# Altium schematic sheet Cover.SchDoc: COVER
size A4; Author: José Báez; CompanyName: Onubense de Sistemas Cuatro-20 S.L.; DrawnBy: José Báez; Address1: C/ Islas Malvinas n.7; Address2: 21007 Huelva; Address3: Spain; DocumentNumber: 1; Revision: 0; SheetNumber: 1; SheetTotal: 7; CreatedDate: 25/09/2026
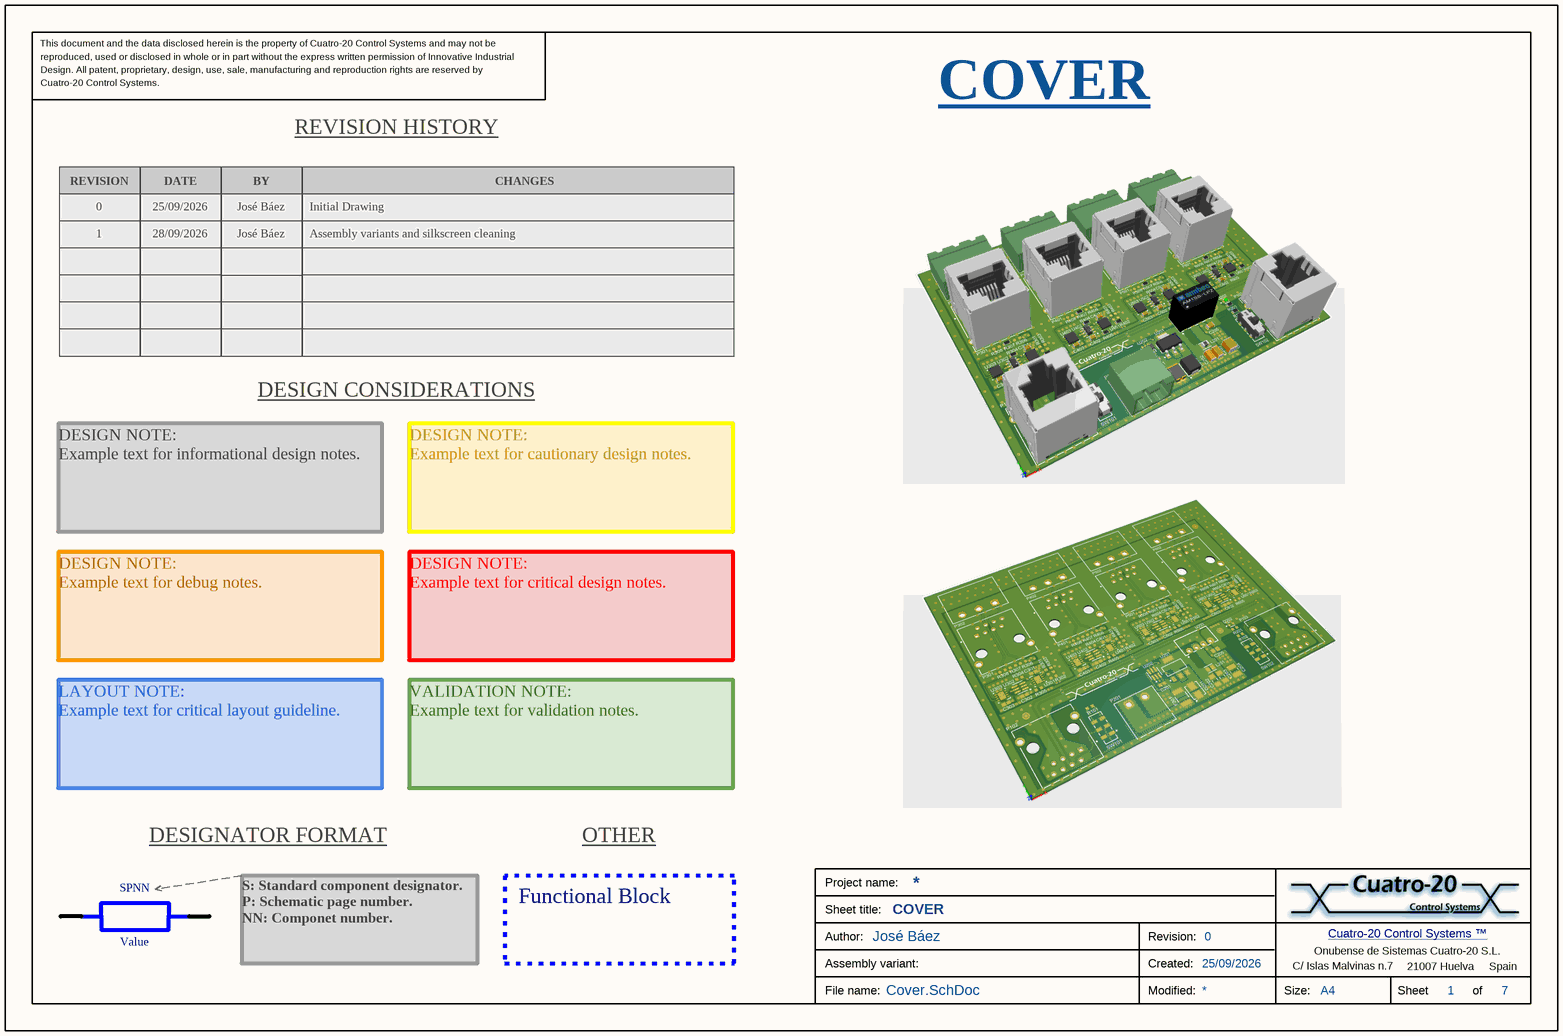
[diagram p0: Cover.SchDoc]

## Parts
RT?  RevisionTable  (value not drawn)  (graphical)

## Notes on the sheet
- (near RT?) 0
- 1
- 28/09/2026
- José Báez
- Initial Drawing
- Assembly variants and silkscreen cleaning
- DESIGN CONSIDERATIONS
- DESIGN NOTE:
  Example text for informational design notes.
- DESIGN NOTE:
  Example text for cautionary design notes.
- DESIGN NOTE:
  Example text for debug notes.
- DESIGN NOTE:
  Example text for critical design notes.
- LAYOUT NOTE:
  Example text for critical layout guideline.
- VALIDATION NOTE:
  Example text for validation notes.
- DESIGNATOR FORMAT
- OTHER
- SPNN
- Functional Block
- Value
- S: Standard component designator.
  P: Schematic page number.
  NN: Componet number.
- This document and the data disclosed herein is the property of Cuatro-20 Control Systems and may not be
- reproduced, used or disclosed in whole or in part without the express written permission of Innovative Industrial
- Design. All patent, proprietary, design, use, sale, manufacturing and reproduction rights are reserved by
- Cuatro-20 Control Systems.
- Project name:
- Sheet title:
- File name:
- Assembly variant:
- Author:
- Modified:
- Created:
- Revision:
- Size:
- A4
- Sheet
- Cuatro-20 Control Systems ™ <www.cuatro-20.com>
- of
- (in symbol RevisionTable) REVISION HISTORY; REVISION; DATE; BY; CHANGES